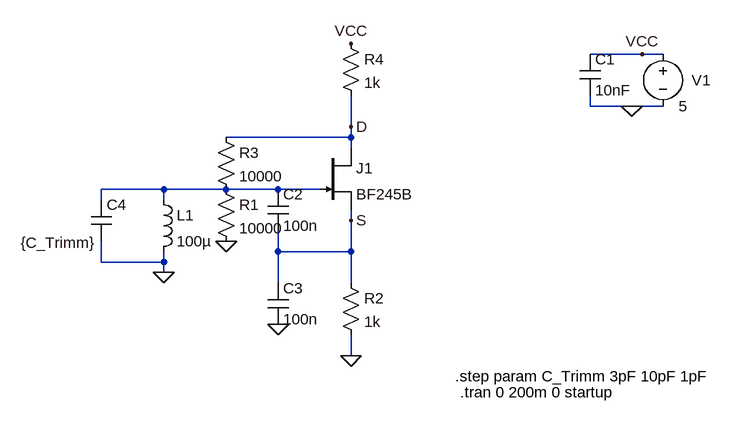
[diagram p0: schematic BF245B-Colpitz.asc]
BF245B-Colpitz.asc, the LTspice schematic file:
Version 4
SHEET 1 880 680
WIRE 192 -80 112 -80
WIRE 224 -80 192 -80
WIRE 112 0 112 -16
WIRE 176 0 112 0
WIRE 224 0 176 0
WIRE -256 32 -256 -16
WIRE -256 48 -256 32
WIRE -256 48 -448 48
WIRE -256 64 -256 48
WIRE -544 128 -640 128
WIRE -448 128 -544 128
WIRE -368 128 -448 128
WIRE -304 128 -368 128
WIRE -640 144 -640 128
WIRE -544 144 -544 128
WIRE -256 176 -256 160
WIRE -368 224 -368 192
WIRE -256 224 -256 176
WIRE -256 224 -368 224
WIRE -640 240 -640 208
WIRE -544 240 -544 224
WIRE -544 240 -640 240
WIRE -544 256 -544 240
WIRE -368 272 -368 224
WIRE -256 272 -256 224
WIRE -256 384 -256 352
FLAG 176 0 0
FLAG 192 -80 VCC
FLAG -256 176 S
FLAG -256 32 D
FLAG -256 384 0
FLAG -256 -96 VCC
FLAG -368 336 0
FLAG -448 208 0
FLAG -544 256 0
SYMBOL voltage 224 -96 R0
WINDOW 123 0 0 Left 0
WINDOW 39 0 0 Left 0
WINDOW 0 44 56 Left 0
SYMATTR InstName V1
SYMATTR Value 5
SYMBOL njf -304 64 R0
SYMATTR InstName J1
SYMATTR Value BF245B
SYMBOL res -272 256 R0
SYMATTR InstName R2
SYMATTR Value 1k
SYMBOL cap 96 -80 R0
SYMATTR InstName C1
SYMATTR Value 10nF
SYMBOL cap -384 128 R0
SYMATTR InstName C2
SYMATTR Value 100n
SYMBOL cap -384 272 R0
SYMATTR InstName C3
SYMATTR Value 100n
SYMBOL ind -560 128 R0
SYMATTR InstName L1
SYMATTR Value 100µ
SYMBOL res -464 112 R0
SYMATTR InstName R1
SYMATTR Value 10000
SYMBOL res -464 32 R0
SYMATTR InstName R3
SYMATTR Value 10000
SYMBOL cap -656 144 R0
WINDOW 3 -108 66 Left 0
SYMATTR Value {C_Trimm}
SYMATTR InstName C4
SYMBOL res -272 -112 R0
SYMATTR InstName R4
SYMATTR Value 1k
TEXT -88 440 Left 0 !.tran 0 200m 0 startup
TEXT -96 416 Left 0 !.step param C_Trimm 3pF 10pF 1pF

The netlist it stands for:
* BF245B-Colpitz.asc
V1 VCC 0 5
J1 D N001 S BF245B
R2 S 0 1k
C1 VCC 0 10nF
C2 N001 S 100n
C3 S 0 100n
L1 N001 0 100µ
R1 N001 0 10000
R3 D N001 10000
C4 N001 0 {C_Trimm}
R4 VCC D 1k
.model NJF NJF
.model PJF PJF
.lib standard.jft
.tran 0 200m 0 startup
.step param C_Trimm 3pF 10pF 1pF
.backanno
.end